# EAGLE design untitled (EAGLE 7.0.0)
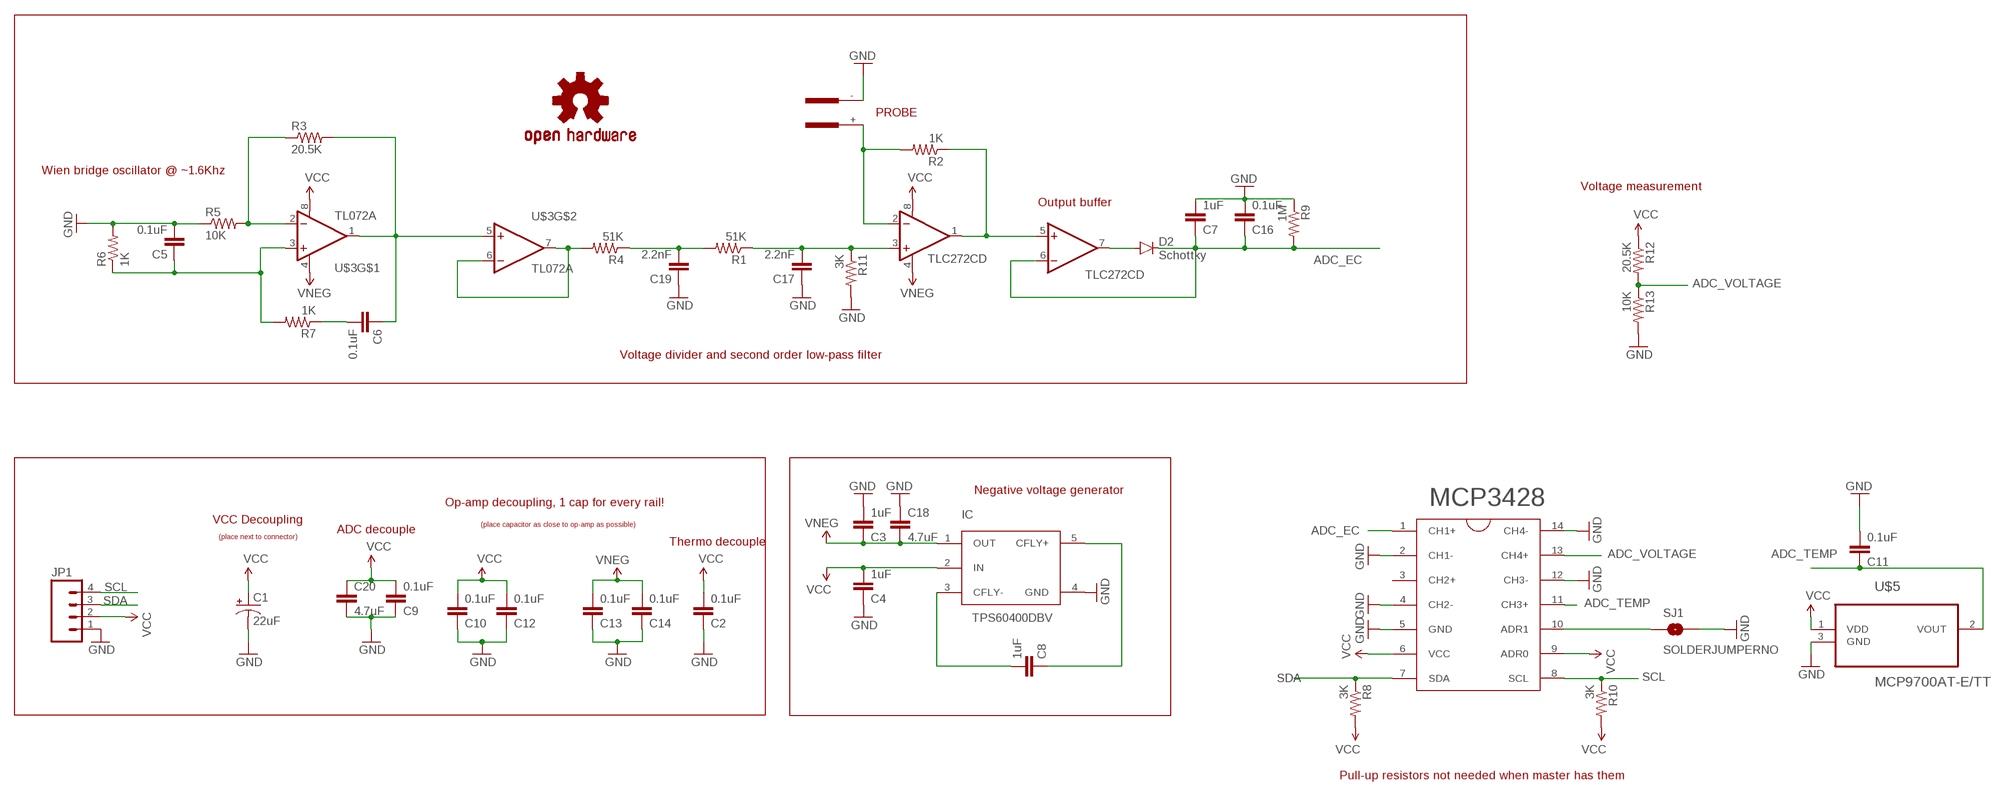
[diagram p0: schematic, sheet 1]

## Parts
C1  22uF  10UF-TANT  [EIA3216]
C2  0.1uF  CAP0603-CAP  [0603-CAP]
C3  1uF  CAP0603-CAP  [0603-CAP]
C4  1uF  CAP0603-CAP  [0603-CAP]
C5  0.1uF  CAP0603-CAP  [0603-CAP]
C6  0.1uF  CAP0603-CAP  [0603-CAP]
C7  1uF  CAP0603-CAP  [0603-CAP]
C8  1uF  CAP0603-CAP  [0603-CAP]
C9  0.1uF  CAP0603-CAP  [0603-CAP]
C10  0.1uF  CAP0603-CAP  [0603-CAP]
C11  0.1uF  CAP0603-CAP  [0603-CAP]
C12  0.1uF  CAP0603-CAP  [0603-CAP]
C13  0.1uF  CAP0603-CAP  [0603-CAP]
C14  0.1uF  CAP0603-CAP  [0603-CAP]
C16  0.1uF  CAP0603-CAP  [0603-CAP]
C17  2.2nF  CAP0603-CAP  [0603-CAP]
C18  4.7uF  CAP0805  [0805]
C19  2.2nF  CAP0603-CAP  [0603-CAP]
C20  4.7uF  CAP0805  [0805]
D2  Schottky  DIODESOD  [SOD-323]
IC  TPS60400DBV  [SOT23-5]
JP1  M04LONGPADS  [1X04_LONGPADS]
LOGO1  OSHW-LOGOM  [OSHW-LOGO-M]
MCP3428  MCP3428  [SO14]
R1  51K  1K-1%  [0603-RES]
R2  1K  1K-1%  [0603-RES]
R3  20.5K  22KOHM1/10W1%(0603)  [0603-RES]
R4  51K  1K-1%  [0603-RES]
R5  10K  10K-1%RES-00824  [0603-RES]
R6  1K  1K-1%  [0603-RES]
R7  1K  1K-1%  [0603-RES]
R8  3K  10K-1%RES-00824  [0603-RES]
R9  1M  10K-1%RES-00824  [0603-RES]
R10  3K  10K-1%RES-00824  [0603-RES]
R11  3K  1K-1%  [0603-RES]
R12  20.5K  1K-1%  [0603-RES]
R13  10K  1K-1%  [0603-RES]
SJ1  SOLDERJUMPERNO  [SJ_2S-NO]
U$1  TLC272CD  TL072A  [SOIC8]
U$2  K1-PROBE  [K1-PROBE]
U$3  TL072A  [SOIC8]
U$5  MCP9700AT-E/TT  [SOT95P237X112-3N]

## Nets
ADC_EC: C7.1 C16.1 D2.C MCP3428.1(CH1+) R9.2 U$1.6(-IN)
ADC_TEMP: C11.1 MCP3428.11(CH3+) U$5.2(VOUT)
ADC_VOLTAGE: MCP3428.13(CH4+) R12.2 R13.1
GND: C1.C(-) C2.1 C3.2 C4.1 C5.2 C7.2 C9.1 C10.1 C11.2 C12.1 C13.1 C14.1 C16.2 C17.1 C18.1 C19.1 C20.2 IC.4(GND) JP1.1 MCP3428.2(CH1-) MCP3428.4(CH2-) MCP3428.5(GND) MCP3428.12(CH3-) MCP3428.14(CH4-) R5.1 R6.2 R9.1 R11.2 R13.2 SJ1.2 U$2.- U$5.3(GND)
N$1: C6.1 R3.2 U$3.1(OUT) U$3.5(+IN)
N$2: R3.1 R5.2 U$3.2(-IN)
N$3: C5.1 R6.1 R7.2 U$3.3(+IN)
N$4: C6.2 R7.1
N$5: R4.2 U$3.6(-IN) U$3.7(OUT)
N$6: C17.2 R1.1 R11.1 U$1.3(+IN)
N$8: R2.1 U$1.1(OUT) U$1.5(+IN)
N$9: R2.2 U$1.2(-IN) U$2.+
N$10: D2.A U$1.7(OUT)
N$13: C8.1 IC.5(CFLY+)
N$14: C8.2 IC.3(CFLY-)
N$48: C19.2 R1.2 R4.1
N$50: MCP3428.10(ADR1) SJ1.1
SCL: JP1.4 MCP3428.8(SCL) R10.1
SDA: JP1.3 MCP3428.7(SDA) R8.1
VCC: C1.A(+) C2.2 C4.2 C9.2 C10.2 C12.2 C20.1 IC.2(IN) JP1.2 MCP3428.6(VCC) MCP3428.9(ADR0) R8.2 R10.2 R12.1 U$1.8(V+) U$3.8(V+) U$5.1(VDD)
VNEG: C3.1 C13.2 C14.2 C18.2 IC.1(OUT) U$1.4(V-) U$3.4(V-)
Unconnected: MCP3428.3(CH2+)

## Notes on the sheet
- PROBE
- Wien bridge oscillator @ ~1.6Khz
- Voltage measurement
- Output buffer
- Voltage divider and second order low-pass filter
- Negative voltage generator
- Op-amp decoupling, 1 cap for every rail!
- VCC Decoupling
- (place capacitor as close to op-amp as possible)
- ADC decouple
- (place next to connector)
- Thermo decouple
- Pull-up resistors not needed when master has them

## Library data of the parts
C1 = SparkFun-Capacitors:10UF-TANT: 10uF Tantalum SMT CAP-00811- 16V 10% (EIA-3216); PROD_ID: CAP-00811; VALUE: 10uF
C2-C14 C16-C20 = SparkFun-Capacitors:CAP: Capacitor Standard 0603 ceramic capacitor, and 0.1" leaded capacitor.
D2 = SparkFun-DiscreteSemi:DIODE: Diode These are standard reverse protection diodes and small signal diodes. SMA package can handle up to about 1A. SOD-323 can handle about 200mA. What the SOD-323 package when ordering, there are some mfgs out there that are 5-pin packages.; PROD_ID: DIO-09646
IC = benkyo:TPS60400DBV
JP1 = SparkFun-Connectors:M04: Header 4 Standard 4-pin 0.1" header. Use with straight break away headers (SKU : PRT-00116), right angle break away headers (PRT-00553), swiss pins (PRT-00743), machine pins (PRT-00117), and female headers (PRT-00115). Molex polarized connector foot print use with SKU : PRT-08231 with associated crimp pins and housings. 1MM SMD Version SKU: PRT-10208
LOGO1 = SparkFun-Aesthetics:OSHW-LOGO: Open Source Hardware Logo This logo indicates the piece of hardware it is found on incorporates a OSHW license and/or adheres to the definition of open source hardware found here: http://freedomdefined.org/OSHW
MCP3428 = benkyo:MCP3428
R1 R2 R4 R6 R7 R11-R13 = SparkFun-Resistors:1K-1%: 1k-ohm SMT 1/10W - 1% (0603) RES-07856; PROD_ID: RES-07856; VALUE: 1k
R3 = SparkFun-Resistors:22KOHM1/10W1%(0603): RES-07853; PROD_ID: RES-07853; VALUE: 22K
R5 R8-R10 = SparkFun-Resistors:10K-1%: 10k-ohm SMT 1/10W - 1% (0603) RES-00824; PROD_ID: RES-00824; VALUE: 10k
SJ1 = SparkFun-Retired:SOLDERJUMPER: Solder Jumper Standard SMD solder jumper. Used to automate production. Two varients : Normally Open and Normally Closed are the same, but have different paste layers. NC will have a large amount of paste and should jumper during reflow.
U$1 U$3 = benkyo:TL072A
U$2 = benkyo2:K1-PROBE
U$5 = benkyo:MCP9700AT-E/TT: Low-Power Linear Active Thermistor; MPN: MCP9700AT-E/TT; OC_FARNELL: 1605577; OC_NEWARK: 84R5199; PACKAGE: SOT-3; SUPPLIER: MICROCHIP

## Board
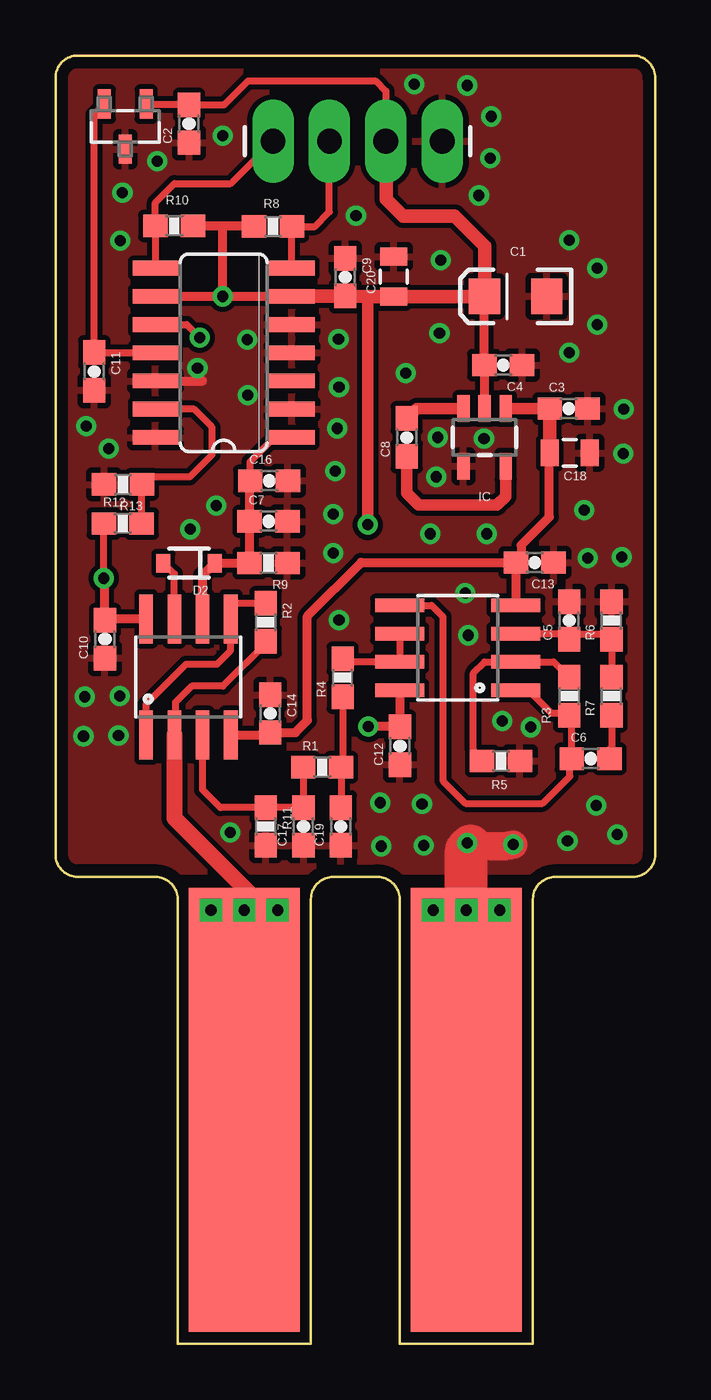
[diagram p1: board, top side]
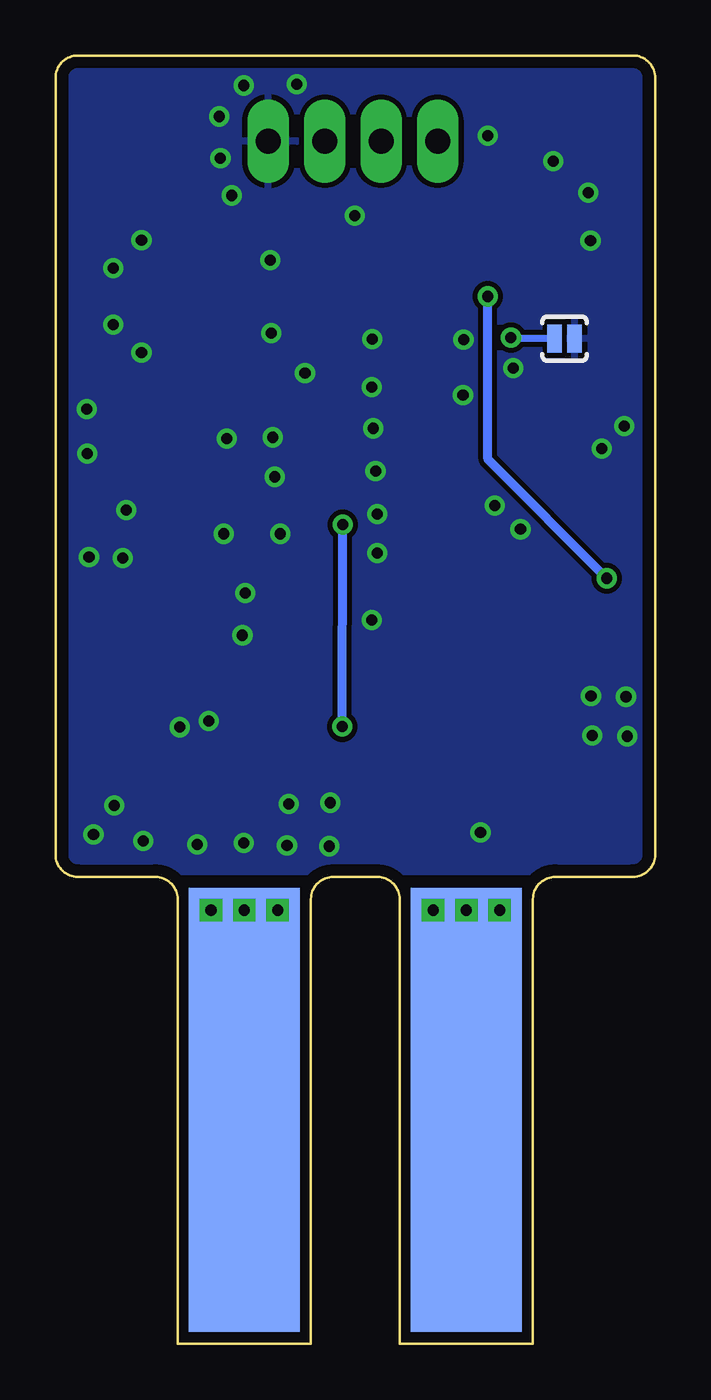
[diagram p2: board, bottom side, seen from below]

Size 27 x 58.04 mm. Coordinates in mm from the lower left corner, seen from the top.
Outline: 5.5,20.04 5.5,0 11.5,0 11.5,20.04 arc-90 12.5,21.04 14.5,21.04 arc-90 15.5,20.04 15.5,0 21.5,0 21.5,20.04 arc-90 22.5,21.04 26,21.04 arc90 27,22.04 27,57.04 arc90 26,58.04 1,58.04 arc90 0,57.04 0,22.04 arc90 1,21.04 4.5,21.04 arc-90 5.5,20.04
Copper layers (1*16): Top 0.035mm / dielectric 1.5mm / Bottom 0.035mm
Design rules "default *": minimum track width 10mil, minimum drill 24mil, track to track 9mil, track to pad 9mil, pad to pad 9mil, via to via 9mil, smd to smd 9mil, copper to edge 20mil, drill to drill 8mil, minimum pad ring 10mil, minimum via ring 8mil, stop-mask expansion 8mil, vias tented up to drill 20mil, thermal gap 10mil

### Footprints (pad centres in the part's own frame; a part is rotated, then mirrored left to right if it is on the bottom)
EIA3216 = smd 1.4 x 1.6: A 1.4,0; C -1.4,0
0603-CAP = smd 1.1 x 1: 1 -0.85,0; 2 0.85,0
0805 = smd 0.8 x 1.2: 1 -0.9,0; 2 0.9,0
SOD-323 = smd 0.63 x 0.83: A 1.15,0; C -1.15,0
SOT23-5 = smd 0.55 x 1.2: 1 -0.95,-1.3; 2 0,-1.3; 3 0.95,-1.3; 4 0.95,1.3; 5 -0.95,1.3
1X04_LONGPADS = drill 1.118 pad 1.88 long: 1 0,0; 2 2.54,0; 3 5.08,0; 4 7.62,0
SO14 = smd 0.66 x 2.032: 1 -3.81,-3.073; 2 -2.54,-3.073; 3 -1.27,-3.073; 4 0,-3.073; 5 1.27,-3.073; 6 2.54,-3.073; 7 3.81,-3.073; 8 3.81,3.073; 9 2.54,3.073; 10 1.27,3.073; 11 0,3.073; 12 -1.27,3.073; 13 -2.54,3.073; 14 -3.81,3.073
0603-RES = smd 1.1 x 1: 1 -0.85,0; 2 0.85,0
SJ_2S-NO = smd 0.635 x 1.27: 1 -0.45,0; 2 0.45,0
SOIC8 = smd 0.61 x 2.21: 1 -1.905,-2.616; 2 -0.635,-2.616; 3 0.635,-2.616; 4 1.905,-2.616; 5 1.905,2.616; 6 0.635,2.616; 7 -0.635,2.616; 8 -1.905,2.616
K1-PROBE = smd 5 x 20: + -5,0; - 5,0 | drill 0.5 square: P$1 5,9; P$2 -5,9; P$5 -6.5,9; P$6 -3.5,9; P$7 3.5,9; P$8 6.5,9 | smd 5 x 20 bottom: P$3 -5,0; P$4 5,0
SOT95P237X112-3N = smd 0.584 x 1.321: 1 -0.94,-1.016; 2 0.94,-1.016; 3 0,1.016

### Placement (x,y rotation side)
C1  20.72,47.19 180 top
C2  6.01,54.96 90 top
C3  23.1,42.14 0 top
C4  20.16,44.09 180 top
C5  23.13,32.59 90 top
C6  24.1,26.36 0 top
C7  9.59,37.06 0 top
C8  15.81,40.84 90 top
C9  13.05,48.05 270 top
C10  2.23,31.75 90 top
C11  1.74,43.81 270 top
C12  15.51,26.95 90 top
C13  21.58,35.2 180 top
C14  9.67,28.39 270 top
C16  9.62,38.88 0 top
C17  11.17,23.31 90 top
C18  23.16,40.14 180 top
C19  12.84,23.31 90 top
C20  15.23,48.08 90 top
D2  6.01,35.18 180 top
IC  19.32,40.84 180 top
JP1  17.41,54.18 180 top
LOGO1  23.38,53.74 90 top
MCP3428  7.57,44.65 90 top
R1  12,25.98 0 top
R2  9.46,32.51 270 top
R3  23.13,29.18 270 top
R4  12.93,30.01 90 top
R5  20.06,26.26 180 top
R6  25.04,32.59 90 top
R7  25.04,29.18 90 top
R8  9.79,50.34 180 top
R9  9.59,35.18 180 top
R10  5.35,50.37 0 top
R11  9.46,23.31 270 top
R12  3.03,36.96 0 top
R13  3.04,38.72 180 top
SJ1  4.08,45.28 0 bottom
U$1  5.99,30.05 0 top
U$2  13.5,10.54 0 top
U$3  18.11,31.36 90 top
U$5  3.14,54.84 180 top

### Tracks (layer width: path | path; a pad name or v marks a point on that pad's centre or on a via)
ADC_EC
  Top 0.305: C16.1 8.77,39.75 9.86,40.84
  Top 0.406: U$1.6 6.62,34.63 D2.C R9.2 C7.1 8.74,38.86 C16.1 | 9.86,40.84 MCP3428.1
ADC_TEMP
  Top 0.305: MCP3428.11 4.49,44.66 C11.1 1.74,55.39 U$5.2
ADC_VOLTAGE
  Top 0.305: R12.2 3.88,39.06 | 3.88,39.06 R13.1 | 3.88,39.06 6.06,39.06 7.05,40.05 7.05,41.3 6.24,42.11 MCP3428.13
GND  (via drill 0.5)
  Top 0.406: MCP3428.12 6.62,43.38
  Top 1.27: 18.68,22.42 20.26,22.42 v20.61,22.5
  Top 1.93: U$2.- 18.5,22.24 18.68,22.42
  other vias: 17.21,40.84 19.29,40.79 20.11,28.06 21.4,27.78 24.4,48.46 24.4,45.92 23.13,49.73 23.13,44.65 25.59,42.11 25.57,40.1 16.88,36.5 19.42,36.5 14.62,24.38 16.5,24.33 14.67,22.42 16.58,22.45 12.51,37.39 1.31,29.16 2.89,29.18 4.59,53.29 6.06,36.7 18.46,33.83 12.77,32.61 18.53,22.58 25.29,22.96 1.26,27.38 7.86,23.03 2.84,27.4 3.01,51.86 8.63,45.23 6.39,43.96 8.65,42.74 12.59,39.32 1.39,41.35 17.29,45.54 15.76,43.74 23.97,35.4 23.82,37.56 25.49,35.46 23.05,22.65 12.51,35.63 7.23,37.77 17.14,39.06 12.69,41.25 12.77,43.1 2.4,40.33 24.35,24.25 18.58,31.92 2.91,49.7 7.53,54.43 13.53,50.82 17.34,48.82 19.62,55.29 18.53,56.69 19.57,53.41 16.14,56.74 19.07,51.74 12.74,45.26
  pour Top: -2,58.04 29,58.04 29,21.28 -2,21.28
  pour Bottom: -2,58.04 29,58.04 29,21.28 -2,21.28
N$1
  Top 0.305: U$3.1 21.28,29.46 22.32,28.42 23.04,28.42 R3.2 23.25,28.22 C6.1 23.16,26.6 23.16,25.57 21.94,24.35 18.46,24.35 17.44,25.37 17.44,32.76 16.93,33.27 U$3.5
N$2
  Top 0.305: R3.1 22.43,30.73 U$3.2 19.32,30.73 18.81,30.22 18.81,26.76 R5.2
N$3
  Top 0.305: U$3.3 22.87,32 arc-90 C5.1 23.37,31.98 24.58,31.98 24.82,31.73 R6.1 R7.2
N$4
  Top 0.305: R7.1 25.04,26.87 24.95,26.78 C6.2
N$5
  Top 0.305: U$3.6 U$3.7 12.93,30.73 R4.2
N$6
  Top 0.305: R1.1 11.15,24.18 C17.2 R11.1 7.42,24.16 6.62,24.96 U$1.3
N$8
  Top 0.305: U$1.1 4.08,28.83 5.88,30.63 7.28,30.63 7.89,31.24 U$1.5 7.89,33.22 8.03,33.36 R2.1
N$9
  Top 0.305: R2.2 9.5,31.61 7.53,29.64 6.14,29.64 5.4,28.9 5.4,27.48 U$1.2
  Top 0.61: 5.99,23.06 8.53,20.52 8.53,10.56 U$2.+
  Top 0.711: U$1.2 5.35,23.7 5.99,23.06 9.16,19.88
N$10
  Top 0.305: U$1.7 5.35,34.69 D2.A
N$13
  Top 0.508: IC.5 20.27,38.18 19.88,37.79 16.35,37.79 15.82,38.32 C8.1
N$14
  Top 0.406: 18.35,42.12 IC.3
  Top 0.508: C8.2 16.27,42.14 IC.3
N$48
  Top 0.305: R4.1 12.93,26.05 R1.2 12.86,24.18 C19.2
N$50  (via drill 0.5)
  Top 0.305: MCP3428.10 5.91,45.92 v6.49,45.34
  Bottom 0.305: SJ1.1 6.44,45.28 v6.49,45.34
SCL
  Top 0.305: MCP3428.8 R10.1 4.5,51.42 5.35,52.27 7.89,52.27 JP1.4
SDA
  Top 0.305: MCP3428.7 R8.1 11.68,50.34 12.34,51 JP1.3
VCC  (via drill 0.5)
  Top 0.305: v2.17,34.49 2.17,37.18 R12.1 | U$5.1 5.97,55.85 C2.2 7.6,55.81 8.68,56.89 14.42,56.89 14.88,56.44 JP1.2
  Top 0.406: C1.A | R10.2 7.53,50.37 | 7.53,50.37 8.92,50.37 R8.2 | v7.53,47.19 MCP3428.6 | v7.53,47.19 7.53,50.37 | C1.A | MCP3428.9 v7.53,47.19 | U$1.8 2.29,32.66 C10.2 2.23,34.44 v2.17,34.49 | U$3.8 15.5,27.81 | 15.5,27.81 C12.2 | 15.5,27.81 v14.09,27.81 | IC.2 C4.2 19.31,47.18 C1.A
  Top 0.508: v14.06,36.9 14.06,47 14.24,47.18
  Top 0.61: MCP3428.6 13.31,47.19 C9.2 14.24,47.18 15.38,47.18 | 15.38,47.18 C20.1 | JP1.2 14.9,54.15 14.9,51.56 15.66,50.8 17.97,50.8 19.32,49.45 C1.A 19.3,47.18 15.38,47.18
  Bottom 0.406: v14.09,27.81 v14.06,36.9 | v2.17,34.49 7.53,39.85 v7.53,47.19
VNEG
  Top 0.406: C18.2 22.24,40.12 22.24,37.26 20.96,35.98 20.96,35.43 C13.2 | C13.2 U$3.4 | U$1.4 9.48,27.43 C14.2 10.8,27.54 11.34,28.09 11.34,32.79 13.76,35.2 C13.2
  Top 0.508: IC.1 C3.1
  Top 0.61: C3.1 C18.2